# Altium schematic sheet RB_Power.SchDoc
size 420 x 297 mm; ApprovedBy: UA3REO; Author: RU4PN; CompanyName: Wolf 2; DocumentNumber: R_BOARD - Power; SheetNumber: 2; SheetTotal: 3
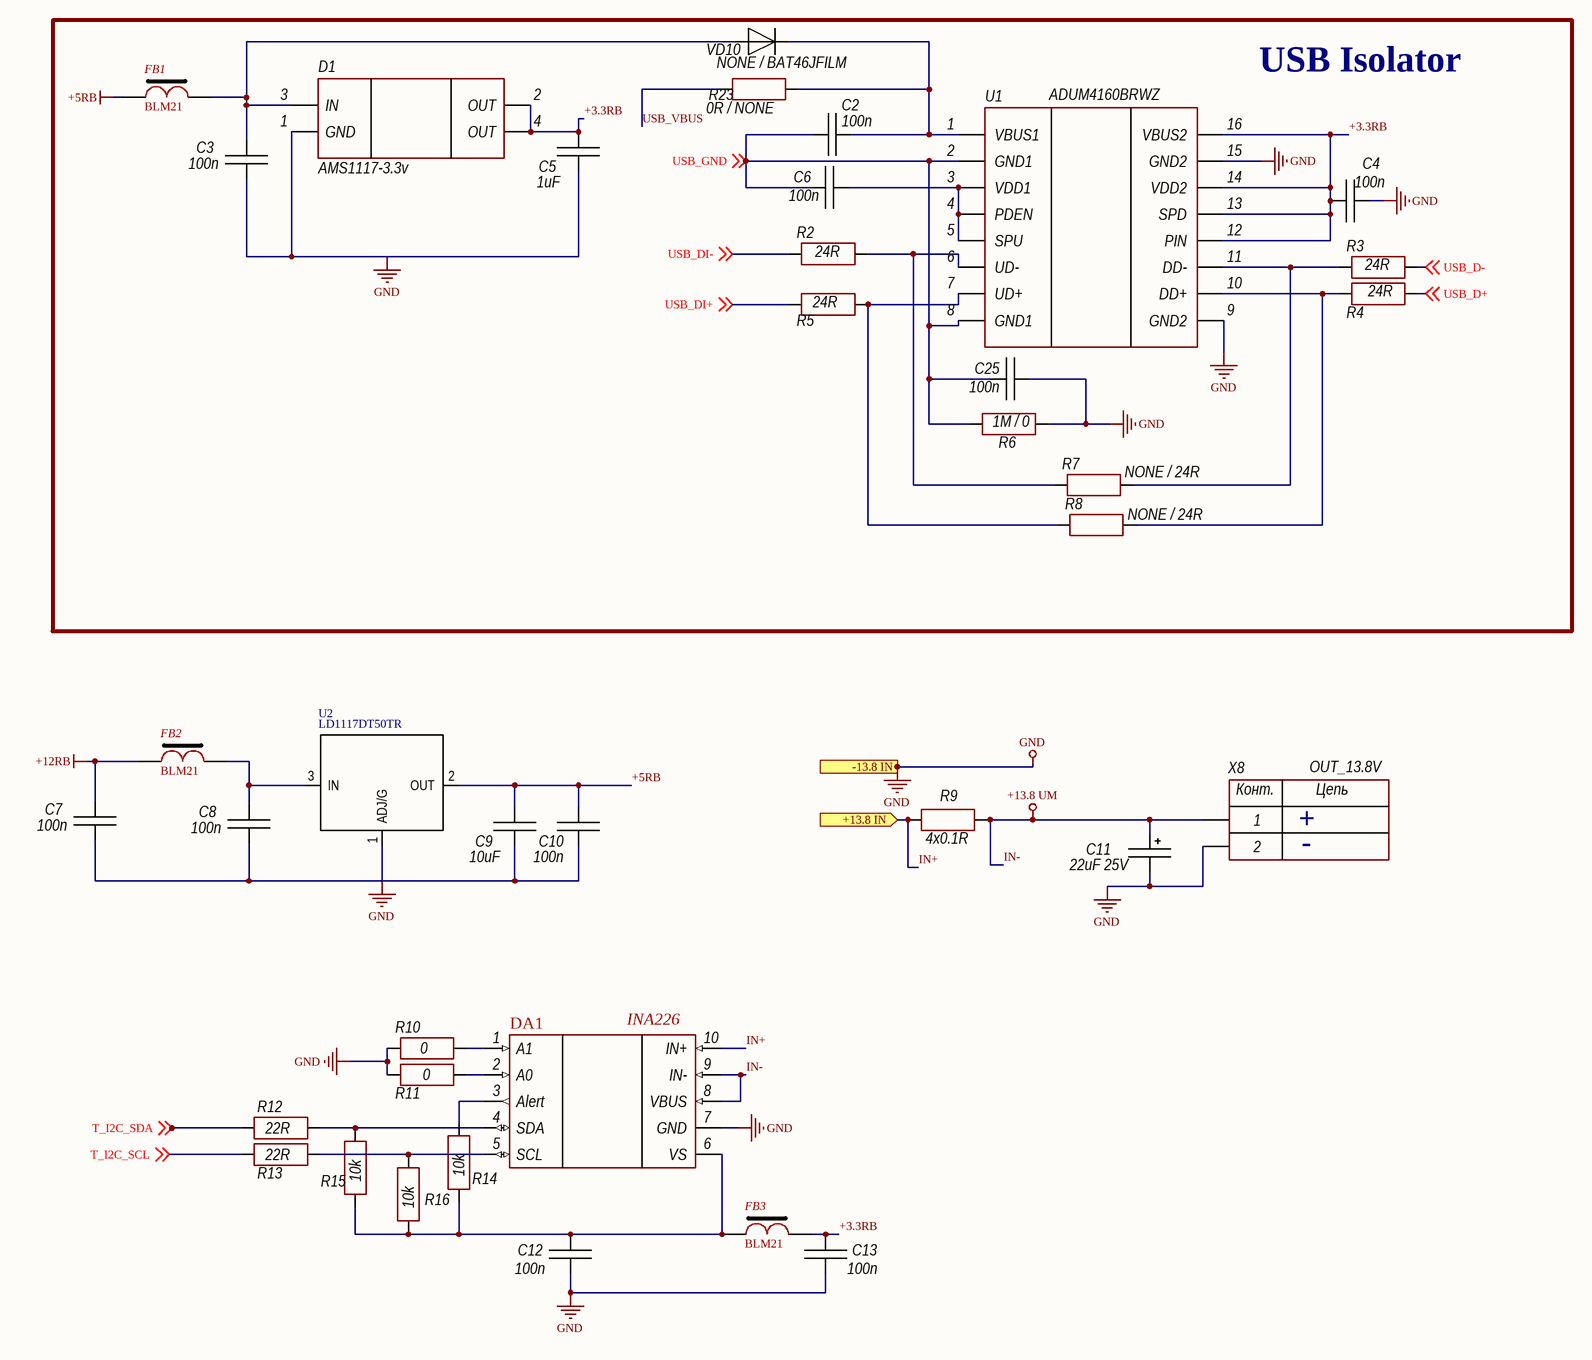
[diagram p0: RB_Power.SchDoc]

## Parts
C2  100n  [CH0805C]
C3  100n  [CH0805C]
C4  100n  [CH0805C]
C5  1uF  [CH0805C]
C6  100n  [CH0805C]
C7  100n  [CH0805C]
C8  100n  [CH0805C]
C9  10uF  [CH0805C]
C10  100n  [CH0805C]
C11  22uF 25V  [TANTAL_D]
C12  100n  [CH0805C]
C13  100n  [CH0805C]
C25  100n  [CH0805C]
D1  AMS1117-3.3v  [SOT223]
DA1  INA226  [10-TSSOP]
FB1  BLM21  [CH0805L]
FB2  BLM21  [CH0805L]
FB3  BLM21  [CH0805L]
R2  24R  [CH0805R]
R3  24R  [CH0805R]
R4  24R  [CH0805R]
R5  24R  [CH0805R]
R6  1M / 0  [CH0805R]
R7  NONE / 24R  [CH0805R]
R8  NONE / 24R  [CH0805R]
R9  4x0.1R  [R-DIP]
R10  0  [CH0805R]
R11  0  [CH0805R]
R12  22R  [CH0805R]
R13  22R  [CH0805R]
R14  10k  [CH0805R]
R15  10k  [CH0805R]
R16  10k  [CH0805R]
R23  0R / NONE  [CH0805R]
U1  ADUM4160BRWZ  [16-SOIC(W)]
U2  LD1117DT50TR  [TO-263-3(123)]
VD10  NONE / BAT46JFILM  [SOD323]
X8  OUT_13.8V  [CON: WF-02]

## Blocks framed on the sheet
USB Isolator: C2-C6 C25 D1 FB1 R2-R8 R23 U1 VD10

## Ports
+13.8 IN (in), -13.8 IN

## Nets
+5RB: C9.2 C10.2 FB1.2 U2.2(OUT)
+12RB: C7.2 FB2.2
GND: C3.1 C4.2 C5.1 C7.1 C8.1 C9.1 C10.1 C11.2 C12.1 C13.1 C25.2 D1.1(GND) DA1.7(GND) R6.2 R10.1 R11.1 U1.9(GND2) U1.15(GND2) U2.1(ADJ/G) X8.2 ; port -13.8 IN
IN-: C11.1 DA1.8(VBUS) DA1.9(IN-) R9.2 X8.1  [also labelled +13.8 UM]
+3.3RB: C4.1 C5.2 C13.2 D1.2(OUT) D1.4(OUT) FB3.1 U1.12(PIN) U1.13(SPD) U1.14(VDD2) U1.16(VBUS2)
IN+: DA1.10(IN+) R9.1 ; port +13.8 IN
T_I2C_SCL: R13.1 ; off-sheet T_I2C_SCL
T_I2C_SDA: R12.1 ; off-sheet T_I2C_SDA
USB_D+: R4.2 ; off-sheet USB_D+
USB_D-: R3.2 ; off-sheet USB_D-
USB_DI+: R5.1 ; off-sheet USB_DI+
USB_DI-: R2.1 ; off-sheet USB_DI-
USB_GND: C2.1 C6.1 C25.1 R6.1 U1.2(GND1) U1.8(GND1) ; off-sheet USB_GND
USB_VBUS: R23.1
NetC2_2: C2.2 R23.2 U1.1(VBUS1) VD10.2
NetC3_2: C3.2 D1.3(IN) FB1.1 VD10.1
NetC6_2: C6.2 U1.3(VDD1) U1.4(PDEN) U1.5(SPU)
NetC8_2: C8.2 FB2.1 U2.3(IN)
NetC12_2: C12.2 DA1.6(VS) FB3.2 R14.1 R15.1 R16.1
NetDA1_1: DA1.1(A1) R10.2
NetDA1_2: DA1.2(A0) R11.2
NetDA1_3: DA1.3(Alert) R14.2
NetDA1_4: DA1.4(SDA) R12.2 R15.2
NetDA1_5: DA1.5(SCL) R13.2 R16.2
NetR2_2: R2.2 R7.1 U1.6(UD-)
NetR3_1: R3.1 R7.2 U1.11(DD-)
NetR4_1: R4.1 R8.2 U1.10(DD+)
NetR5_2: R5.2 R8.1 U1.7(UD+)

## Notes on the sheet
- +
- -
- Перв. примен.
- Справ. №
- Подп. и дата
- Инв. № дубл.
- Взам. инв. №
- Разраб.
- Изм.
- Лист
- № докум.
- Подп.
- Дата
- Лит.
- Масса
- Масштаб
- Пров.
- Т.контр.
- Листов
- Инв. № подл.
- Утв.
- Н.контр.
- 2.106-A3
- Копировал
- Формат А3
- (in symbol 2-Connector) Конт.; Цепь

## Library data of the parts
C2-C10 C12 C13 C25 = Capacitor: Manufacturer: *; Model: *; HelpURL: *; ComponentKind: *; Value: *
C11 = TantalCap: Manufacturer: *; Model: *; HelpURL: *; ComponentKind: *; Value: *
D1 = NCP1117LPST50T3G: LDO; Manufacturer: ON Semiconductor; Model: NCP1117LPST50T3G; HelpURL: https://www.digikey.com/product-detail/en/on-semiconductor/NCP1117LPST50T3G/NCP1117LPST50T3GOSCT-ND/5801728; ComponentKind: SOT-223
FB1-FB3 = FB-1
R2-R16 R23 = Resistor: Manufacturer: *; Model: *; HelpURL: *; ComponentKind: *; Value: *
U1 = ADUM3160BRWZ: Isolator USB; Manufacturer: Analog Devices Inc.; Model: ADUM3160BRWZ; HelpURL: https://www.digikey.com/product-detail/en/analog-devices-inc/ADUM3160BRWZ/ADUM3160BRWZ-ND/2361054; ComponentKind: 16-SOIC
U2 = LM1084
VD10 = Diod: ComponentKind: *; Manufacturer: *; Model: *; HelpURL: *
X8 = 2-Connector: Model: *; Manufacturer: *; HelpURL: *; ComponentKind: *